# Altium schematic sheet 13 MISC.SchDoc
size 513 x 386 mm
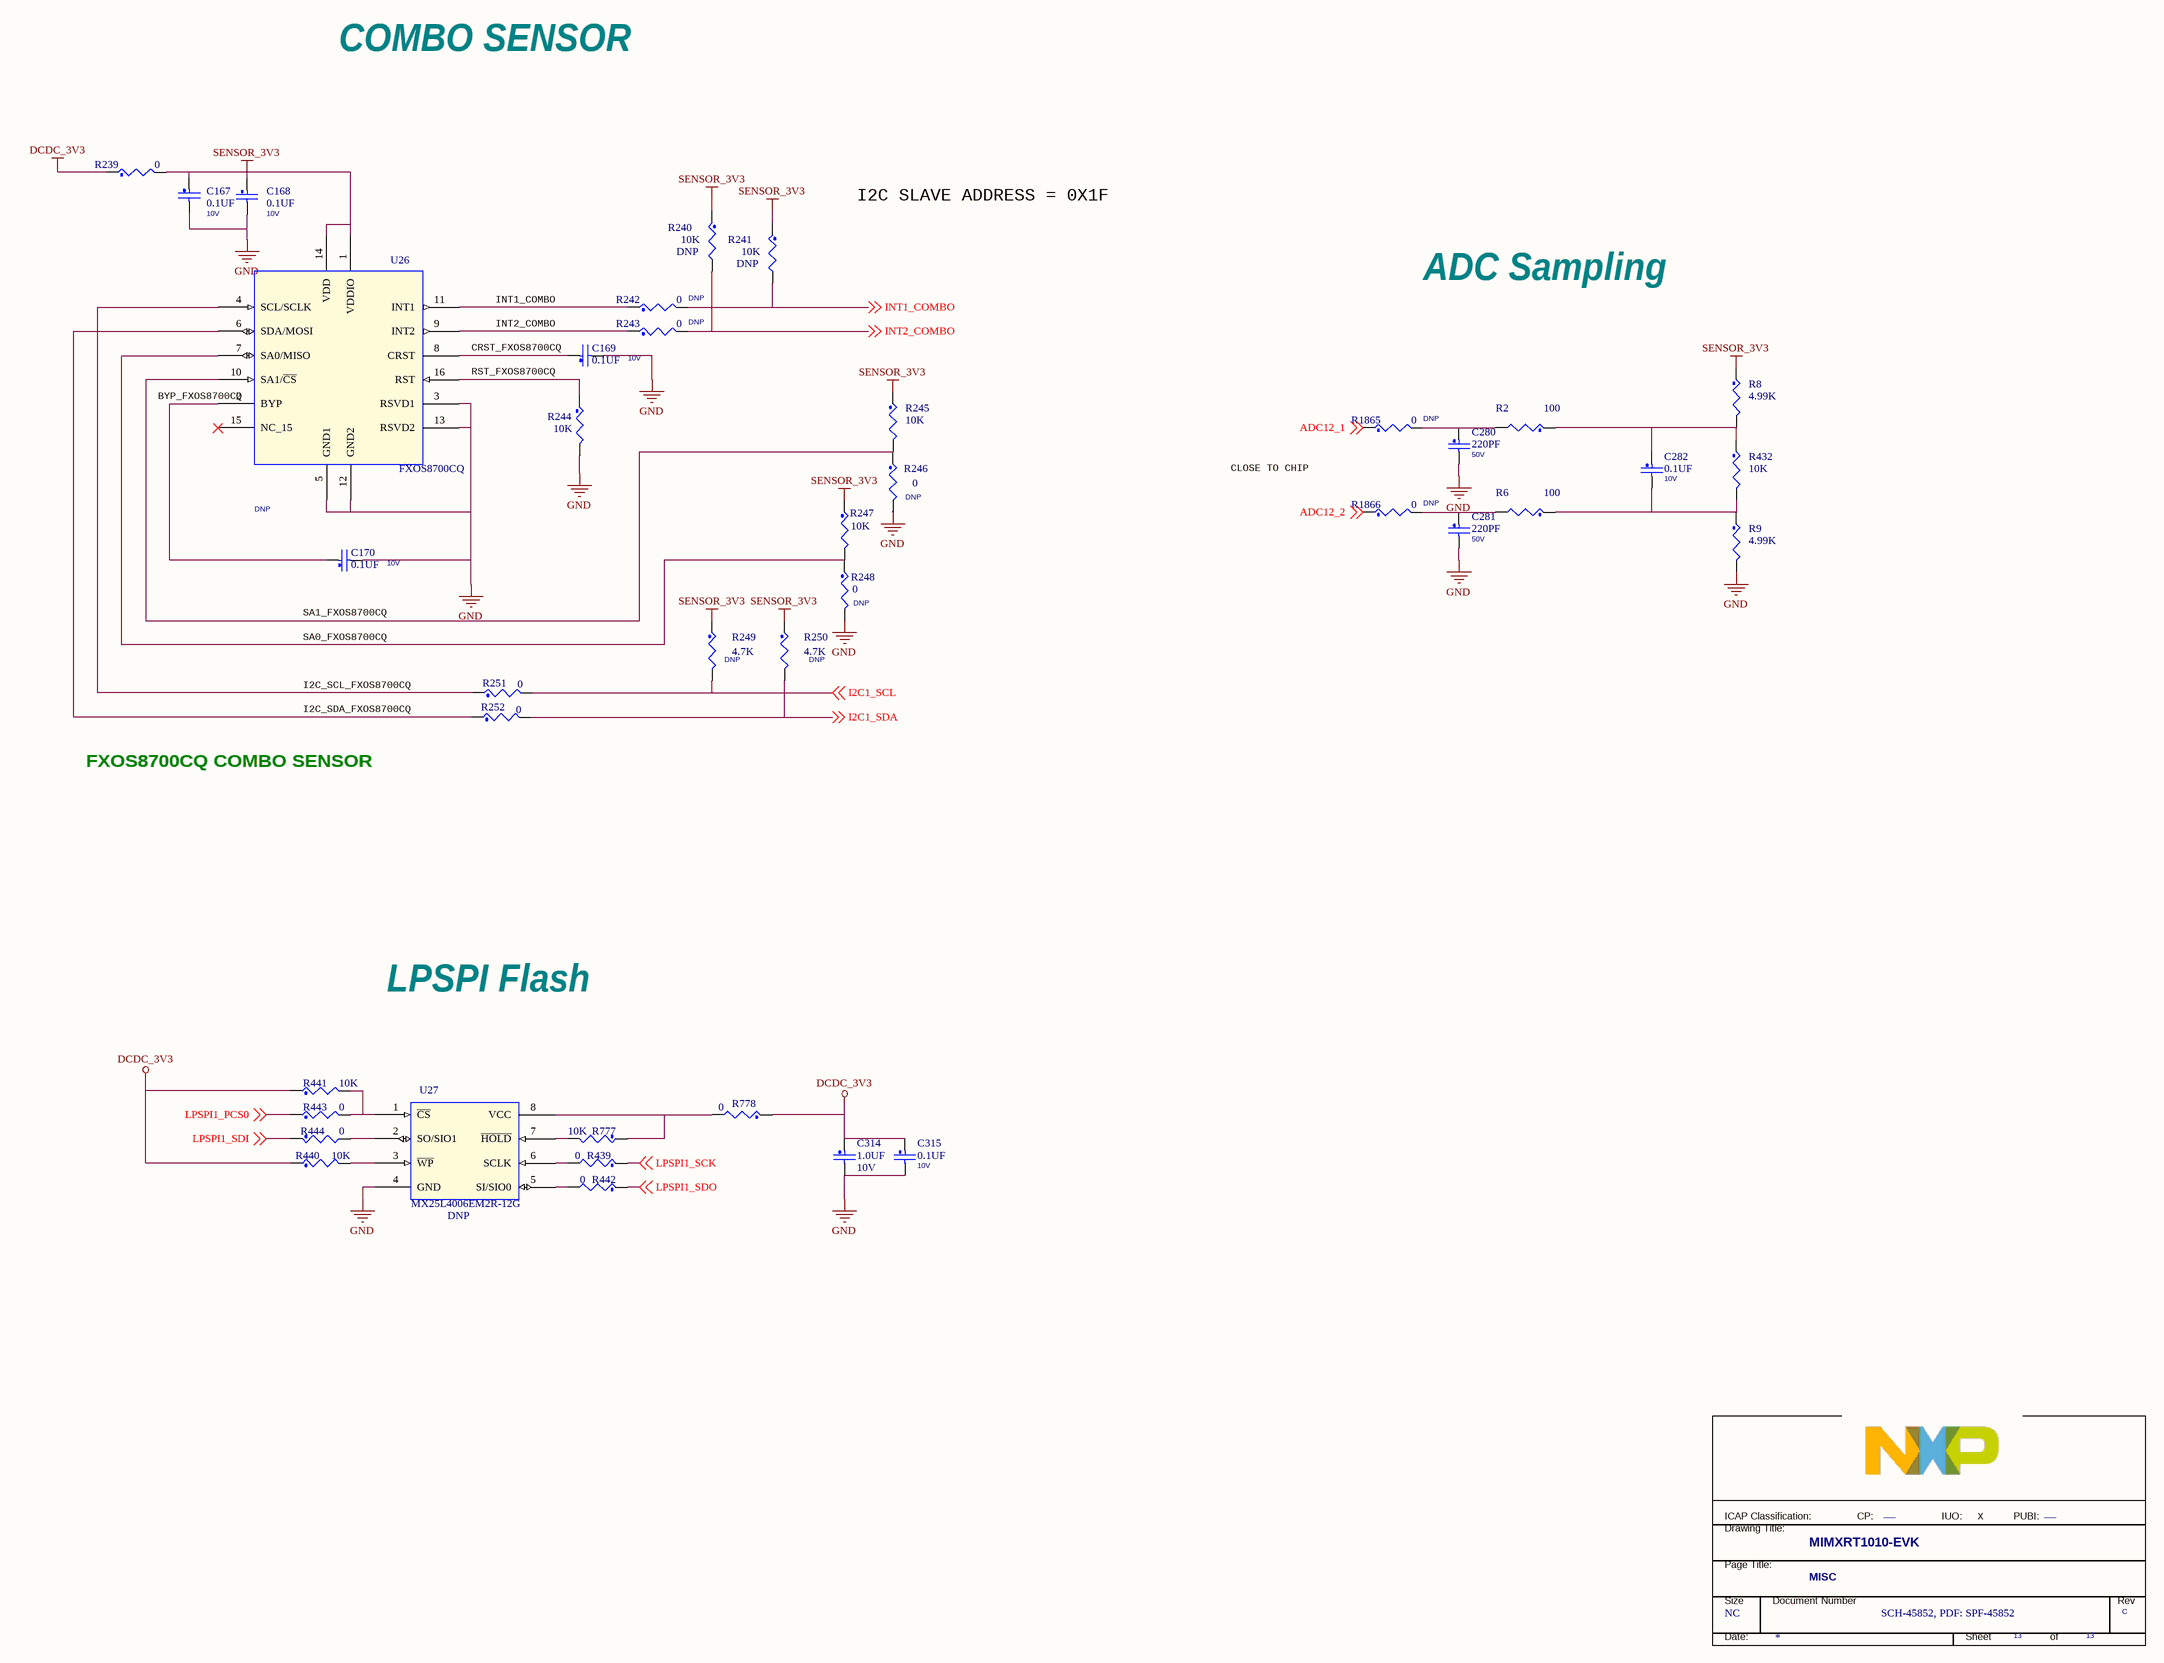
[diagram p0: 13 MISC.SchDoc]

## Parts
*  PUBI: ___  Doc: SCH-45852, PDF: SPF-45852  RevCode: C  Title: MIMXRT1010-EVK  Page Size: NC  Page Number: 13  PageTitle: MISC  (hidden comment: TitleBlock_FS)  (graphical)
C167  0.1UF  VOLTAGE: 10V  [CC0402_25]
C168  0.1UF  VOLTAGE: 10V  [CC0402_25]
C169  0.1UF  VOLTAGE: 10V  [CC0402_25]
C170  0.1UF  VOLTAGE: 10V  [CC0402_25]
C280  220PF  VOLTAGE: 50V  [CC0402_25]
C281  220PF  VOLTAGE: 50V  [CC0402_25]
C282  0.1UF  VOLTAGE: 10V  [CC0402_25]
C314  1.0UF  voltage rating: 10V  [0402_CC]
C315  0.1UF  VOLTAGE: 10V  [0402_CC]
R2  100  [RC0402_25]
R6  100  [RC0402_25]
R8  4.99K  [RC0402_25]
R9  4.99K  [RC0402_25]
R239  0  [0402_CC]
R240  10K  ASSY_OPT: DNP  [0402_CC]
R241  10K  ASSY_OPT: DNP  [0402_CC]
R242  0  ASSY_OPT: DNP  [0402_CC]
R243  0  ASSY_OPT: DNP  [0402_CC]
R244  10K  [0402_CC]
R245  10K  [0402_CC]
R246  0  ASSY_OPT: DNP  [0402_CC]
R247  10K  [0402_CC]
R248  0  ASSY_OPT: DNP  [0402_CC]
R249  4.7K  ASSY_OPT: DNP  [RC0402_25]
R250  4.7K  ASSY_OPT: DNP  [RC0402_25]
R251  0  [0402_CC]
R252  0  [0402_CC]
R432  10K  [0402_CC]
R439  0  [0402_CC]
R440  10K  [0402_CC]
R441  10K  [0402_CC]
R442  0  [0402_CC]
R443  0  [0402_CC]
R444  0  [0402_CC]
R777  10K  [0402_CC]
R778  0  [0402_CC]
R1865  0  ASSY_OPT: DNP  [0402_CC]
R1866  0  ASSY_OPT: DNP  [0402_CC]
U26  FXOS8700CQ  ASSY_OPT: DNP  [QFN5X3_0P5_3X3]
U27  MX25L4006EM2R-12G  ASSY_OPT: DNP  [SO8-25X75-200]

## Nets
DCDC_3V3: C314.1 C315.1 R239.1 R440.1 R441.1 R778.1
GND: C167.2 C168.2 C169.2 C170.2 C280.2 C281.2 C314.2 C315.2 R9.2 R244.2 R246.2 R248.2 U26.3(RSVD1) U26.5(GND1) U26.12(GND2) U26.13(RSVD2) U27.4(GND)
SENSOR_3V3: C167.1 C168.1 R8.1 R239.2 R240.1 R241.1 R245.1 R247.1 R249.1 R250.1 U26.1(VDDIO) U26.14(VDD)
ADC12_1: R1865.1 ; off-sheet ADC12_1
ADC12_2: R1866.1 ; off-sheet ADC12_2
I2C1_SCL: R249.2 R251.2 ; off-sheet I2C1_SCL
I2C1_SDA: R250.2 R252.2 ; off-sheet I2C1_SDA
INT1_COMBO: R241.2 R242.2 ; off-sheet INT1_COMBO
INT2_COMBO: R240.2 R243.2 ; off-sheet INT2_COMBO
LPSPI1_PCS0: R443.1 ; off-sheet LPSPI1_PCS0
LPSPI1_SCK: R439.1 ; off-sheet LPSPI1_SCK
LPSPI1_SDI: R444.1 ; off-sheet LPSPI1_SDI
LPSPI1_SDO: R442.1 ; off-sheet LPSPI1_SDO
NetC169_1: C169.1 U26.8(CRST)
NetC170_1: C170.1 U26.2(BYP)
NetC280_1: C280.1 R2.2 R1865.2
NetC281_1: C281.1 R6.2 R1866.2
NetC282_1: C282.1 R2.1 R8.2 R432.1
NetC282_2: C282.2 R6.1 R9.1 R432.2
NetR242_1: R242.1 U26.11(INT1)
NetR243_1: R243.1 U26.9(INT2)
NetR244_1: R244.1 U26.16(RST)
NetR245_2: R245.2 R246.1 U26.10(SA1/~{CS})
NetR247_2: R247.2 R248.1 U26.7(SA0/MISO)
NetR251_1: R251.1 U26.4(SCL/SCLK)
NetR252_1: R252.1 U26.6(SDA/MOSI)
NetR439_2: R439.2 U27.6(SCLK)
NetR440_2: R440.2 U27.3(~{WP})
NetR441_2: R441.2 R443.2 U27.1(~{CS})
NetR442_2: R442.2 U27.5(SI/SIO0)
NetR444_2: R444.2 U27.2(SO/SIO1)
NetR777_1: R777.1 R778.2 U27.8(VCC)
NetR777_2: R777.2 U27.7(~{HOLD})

Not connected (* = marked no-connect by the designer): U26 15(NC_15)*

## Notes on the sheet
- COMBO SENSOR
- I2C SLAVE ADDRESS = 0X1F
- ADC Sampling
- CRST_FXOS8700CQ
- INT1_COMBO
- (near C169) INT2_COMBO
- (near U26) BYP_FXOS8700CQ
- RST_FXOS8700CQ
- CLOSE TO CHIP
- SA1_FXOS8700CQ
- SA0_FXOS8700CQ
- I2C_SCL_FXOS8700CQ
- I2C_SDA_FXOS8700CQ
- FXOS8700CQ COMBO SENSOR
- LPSPI Flash
- X
- (in symbol TitleBlock_FS) ICAP Classification:; CP:; IUO:; PUBI:; Drawing Title:; Page Title:; Size; Document Number; Rev; Date:; Sheet; of

## Library data of the parts
* = TitleBlock_FS: FIUO: _X_; OrgAddr2: Austin, TX 78735-8598; OrgAddr1: 6501 William Cannon Drive West; OrgName: Freescale Semiconductor; FCP: ___; Page Create Date: March  8, 1995; Page Count: 13; Page Modify Date: *
C167 C169 C282 = CAP_NP: CAP CER 0.1UF 10V 10% X5R 0402; CLASS: DISCRETE; FPLIST: CC0402_25,CC0402_HD,0402_CC; CAD_APPROVED: Yes; MFG_PN01: CC0402KRX5R6BB104; MFG_NAME01: YAGEO AMERICA; AGILE_PN: 150-75634; HEIGHT: 0.64MM; ROHS: Yes; Tolerance: 10%; PCB Footprint: CC0402_25
C168 C170 C315 = CAP_NP: CAP CER 0.1UF 10V 10% X5R 0402; CLASS: DISCRETE; AGILE_PN: 150-75634; MFG_NAME01: YAGEO AMERICA; MFG_PN01: CC0402KRX5R6BB104; CAD_APPROVED: Yes; FPLIST: CC0402_25,CC0402_HD,0402_CC; Tolerance: 10%; ROHS: Yes; HEIGHT: 0.64MM
  C168 C170: PCB Footprint: CC0402_25
  C315: PCB Footprint: 0402_CC
C280 = CAP_NP: CAP CER 220PF 50V 5% C0G 0402; CLASS: DISCRETE; FPLIST: CC0402_25,CC0402_HD,0402_CC; CAD_APPROVED: Yes; MFG_PN01: C0402C221J5GAC; MFG_NAME01: KEMET; AGILE_PN: 150-30297; HEIGHT: 0.55MM; ROHS: Yes; Tolerance: 5%; PCB Footprint: CC0402_25
C281 = CAP_NP: CAP CER 220PF 50V 5% C0G 0402; CLASS: DISCRETE; AGILE_PN: 150-30297; MFG_NAME01: KEMET; MFG_PN01: C0402C221J5GAC; CAD_APPROVED: Yes; FPLIST: CC0402_25,CC0402_HD,0402_CC; Tolerance: 5%; ROHS: Yes; HEIGHT: 0.55MM; PCB Footprint: CC0402_25
C314 = CAP_NP: CAP CER 1.0UF 10V 10% X5R 0402; CLASS: DISCRETE; FPLIST: CC0402_25,CC0402_HD,0402_CC; CAD_APPROVED: Yes; MFG_PN01: CC0402KRX5R6BB105; MFG_NAME01: YAGEO AMERICA; AGILE_PN: 150-75772; VOLTAGE: 10V; HEIGHT: 0.6MM; ROHS: Yes; PCB Footprint: 0402_CC
R2 R6 = RES_Dup1: RES MF 100 OHM 1/16W 1% 0402; CLASS: DISCRETE; AGILE_PN: 470-30454; MFG_NAME01: THYE MING TECH CO LTD; MFG_PN01: CR-02FL6--100R; CAD_APPROVED: Yes; FPLIST: RC0402_25,RC0402_HD,0402_CC; Tolerance: 1%; ROHS: Yes; TOL: 1%; HEIGHT: 0.4 MM; PCB Footprint: RC0402_25
R8 R9 = RES_Dup1: RES MF 4.99K 1/16W 1% 0402; CLASS: DISCRETE; FPLIST: RC0402_25,RC0402_HD,0402_CC; CAD_APPROVED: Yes; MFG_PN01: RC0402FR-074K99L; MFG_NAME01: YAGEO AMERICA; AGILE_PN: 470-81149; HEIGHT: 0.4 MM; ROHS: Yes; Tolerance: 1%; PCB Footprint: RC0402_25
R239 R242 R243 R248 R439 R442-R444 R1865 = RES_Dup1: RES MF ZERO OHM 1/16W 5% 0402; CLASS: DISCRETE; AGILE_PN: 470-75394; MFG_NAME01: ROHM; MFG_PN01: MCR01MZPJ000; CAD_APPROVED: Yes; FPLIST: RC0402_25,RC0402_HD,RC0402_X2,0402_CC; HEIGHT: 0.45 MM; Tolerance: 5%; ROHS: Yes; PCB Footprint: 0402_CC
R240 R241 R244 R440 R777 = RES_Dup1: RES MF 10K 1/16W 5% 0402; CLASS: DISCRETE; AGILE_PN: 470-75557; MFG_NAME01: VISHAY INTERTECHNOLOGY; MFG_PN01: CRCW040210K0JNED; CAD_APPROVED: Yes; FPLIST: RC0402_25,RC0402_HD,0402_CC; Tolerance: 5%; ROHS: Yes; HEIGHT: 0.4 MM; PCB Footprint: 0402_CC
R245 R247 R432 R441 = RES_Dup1: RES MF 10K 1/16W 5% 0402; CLASS: DISCRETE; FPLIST: RC0402_25,RC0402_HD,0402_CC; CAD_APPROVED: Yes; MFG_PN01: CRCW040210K0JNED; MFG_NAME01: VISHAY INTERTECHNOLOGY; AGILE_PN: 470-75557; HEIGHT: 0.4 MM; ROHS: Yes; Tolerance: 5%; PCB Footprint: 0402_CC
R246 R251 R252 R778 R1866 = RES_Dup1: RES MF ZERO OHM 1/16W 5% 0402; CLASS: DISCRETE; FPLIST: RC0402_25,RC0402_HD,RC0402_X2,0402_CC; CAD_APPROVED: Yes; MFG_PN01: MCR01MZPJ000; MFG_NAME01: ROHM; AGILE_PN: 470-75394; ROHS: Yes; Tolerance: 5%; HEIGHT: 0.45 MM; PCB Footprint: 0402_CC
R249 R250 = RES_Dup1: RES MF 4.7K 1/16W 5% 0402; CLASS: DISCRETE; FPLIST: RC0402_25,RC0402_HD,0402_CC; CAD_APPROVED: Yes; MFG_PN01: NRCL04J472TRF; MFG_NAME01: NIC COMPONENTS CORP; AGILE_PN: 470-75626; PCB Footprint: RC0402_25; HEIGHT: 0.41mm; ROHS: Yes; Tolerance: 5%
U26 = FXOS8700CQ_QFN_16P: IC ACCELEROMETER AND MAGNETOMETER SENSOR 3-AXIS 2.5V QFN16; FPLIST: QFN5X3_0P5_3X3,QFN5X3_0P5_3X3_a; CAD_APPROVED: Yes; MFG_NAME01: Freescale Semiconductor; AGILE_PN: 312-80418; CLASS: IC; HEIGHT: 1.25MM; ROHS: Yes; MFG_PN01: FXOS8700CQ; PCB Footprint: QFN5X3_0P5_3X3
U27 = MX25L6406EM2I_SOP8: IC MEM FLASH SPI 4MBIT 86MHZ 2.7-3.6V AUTOMOTIVE SOP8; AGILE_PN: 334-77823; MFG_NAME01: MACRONIX INTERNATIONAL CO., LTD; Temp_Range: -40¡ãC ~ 105¡ãC; CAD_APPROVED: Yes; CLASS: IC; MFG_PN01: MX25L4006EM2R-12G; ROHS: Yes; HEIGHT: 2.16MM; PCB Footprint: SO8-25X75-200